# Altium project phoenix-c1.PrjPcb (part 1 of 3)
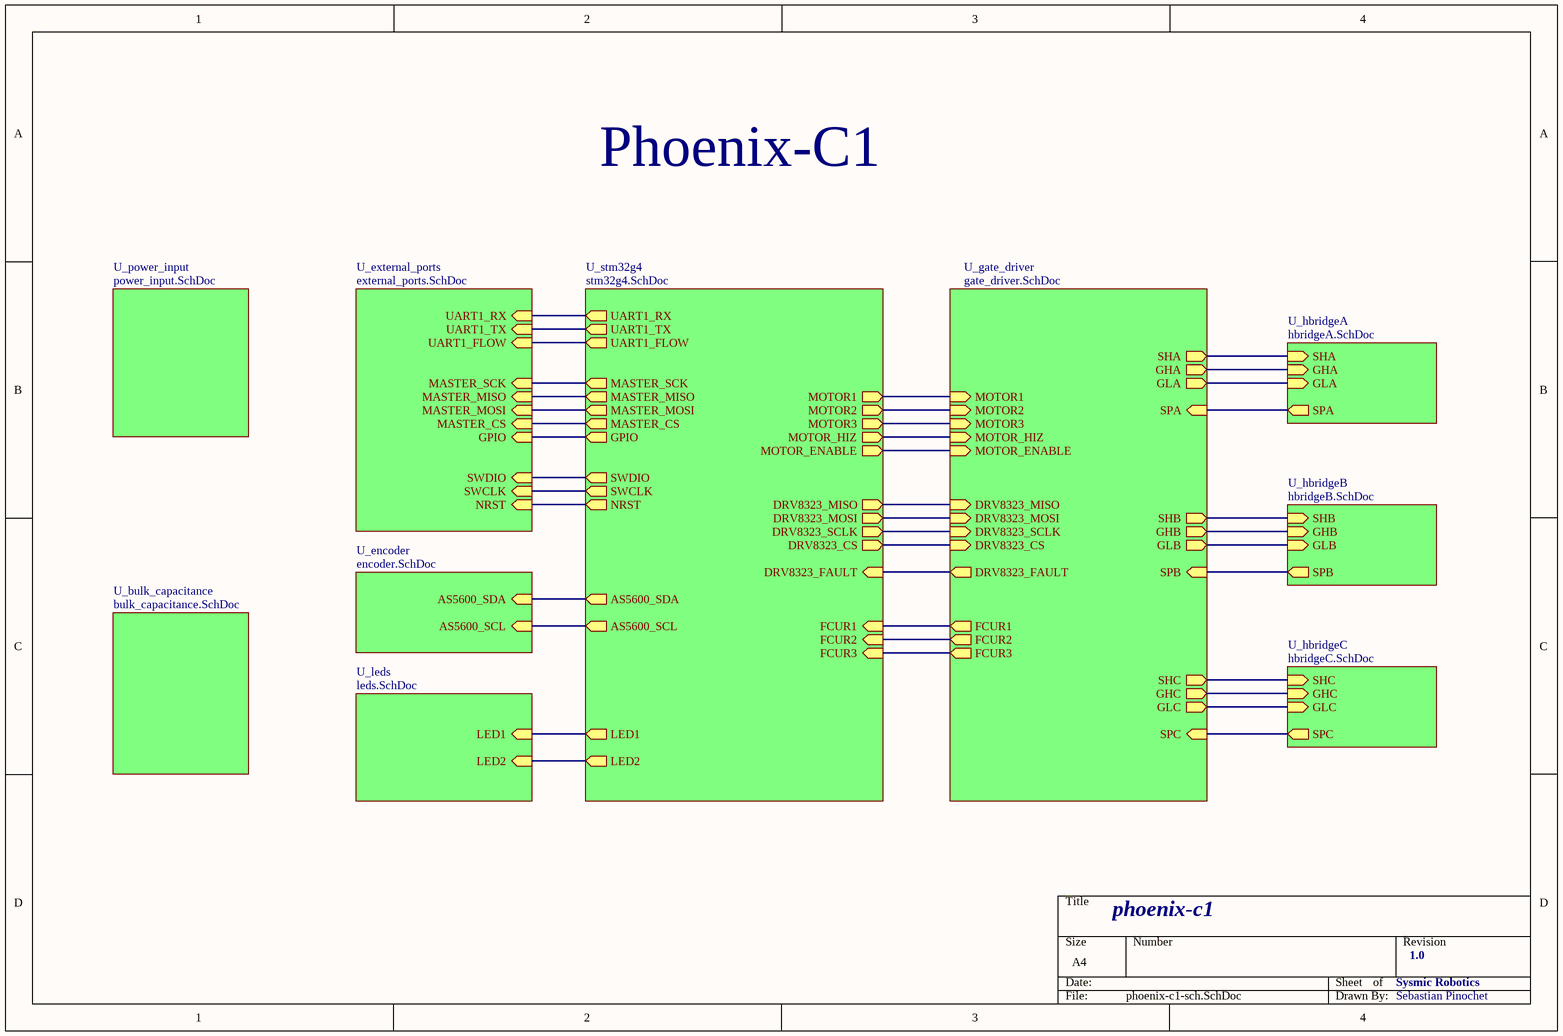
[diagram p0: phoenix-c1-sch.SchDoc]
11 sheets, 71 parts. Net scope: hierarchical (ports join the sheet entries above them; power ports are global).
Board file: phoenix-c1.PcbDoc
Sheets:
  phoenix-c1-sch.SchDoc
    U_bulk_capacitance = bulk_capacitance.SchDoc
    U_encoder = encoder.SchDoc
    U_hbridgeA = hbridgeA.SchDoc
    U_hbridgeB = hbridgeB.SchDoc
    U_hbridgeC = hbridgeC.SchDoc
    U_power_input = power_input.SchDoc
    U_stm32g4 = stm32g4.SchDoc
    U_external_ports = external_ports.SchDoc
    U_leds = leds.SchDoc
    U_gate_driver = gate_driver.SchDoc

## Sheet phoenix-c1-sch.SchDoc
size A4; SheetNumber: 1; SheetTotal: 11

### Sub-sheets
U_bulk_capacitance = bulk_capacitance.SchDoc: no entries
U_encoder = encoder.SchDoc: AS5600_SCL (in), AS5600_SDA (in)
U_external_ports = external_ports.SchDoc: SWCLK (in), NRST (in), SWDIO (in), GPIO (in), MASTER_CS (in), MASTER_MOSI (in), MASTER_MISO (in), MASTER_SCK (in), UART1_RX (in), UART1_TX (in), UART1_FLOW (in)
U_gate_driver = gate_driver.SchDoc: MOTOR2 (in), MOTOR1 (in), MOTOR3 (in), MOTOR_ENABLE (in), DRV8323_MISO (in), DRV8323_MOSI (in), DRV8323_SCLK (in), DRV8323_CS (in), MOTOR_HIZ (in), DRV8323_FAULT (out), GHA (out), SHA (out), GLA (out), SPA (in), GHB (out), SHB (out), GLB (out), SPB (in), GHC (out), SHC (out), GLC (out), SPC (in), FCUR1 (out), FCUR2 (out), FCUR3 (out)
U_hbridgeA = hbridgeA.SchDoc: SHA (in), GHA (in), SPA (out), GLA (in)
U_hbridgeB = hbridgeB.SchDoc: SHB (in), GHB (in), SPB (out), GLB (in)
U_hbridgeC = hbridgeC.SchDoc: SHC (in), GHC (in), SPC (out), GLC (in)
U_leds = leds.SchDoc: LED1 (in), LED2 (in)
U_power_input = power_input.SchDoc: no entries
U_stm32g4 = stm32g4.SchDoc: MOTOR1 (out), MOTOR2 (out), MOTOR3 (out), FCUR1 (in), FCUR2 (in), FCUR3 (in), AS5600_SCL (out), AS5600_SDA (out), DRV8323_SCLK (out), DRV8323_MISO (out), DRV8323_MOSI (out), DRV8323_CS (out), DRV8323_FAULT (in), MOTOR_HIZ (out), MOTOR_ENABLE (out), GPIO (out), MASTER_CS (out), MASTER_MOSI (out), MASTER_MISO (out), MASTER_SCK (out), UART1_RX (out), UART1_TX (out), UART1_FLOW (out), LED1 (out), LED2 (out), SWCLK (out), NRST (out), SWDIO (out)

### Nets
AS5600_SCL: sheet U_encoder/AS5600_SCL, sheet U_stm32g4/AS5600_SCL
AS5600_SDA: sheet U_encoder/AS5600_SDA, sheet U_stm32g4/AS5600_SDA
DRV8323_CS: sheet U_stm32g4/DRV8323_CS, sheet U_gate_driver/DRV8323_CS
DRV8323_FAULT: sheet U_stm32g4/DRV8323_FAULT, sheet U_gate_driver/DRV8323_FAULT
DRV8323_MISO: sheet U_stm32g4/DRV8323_MISO, sheet U_gate_driver/DRV8323_MISO
DRV8323_MOSI: sheet U_stm32g4/DRV8323_MOSI, sheet U_gate_driver/DRV8323_MOSI
DRV8323_SCLK: sheet U_stm32g4/DRV8323_SCLK, sheet U_gate_driver/DRV8323_SCLK
FCUR1: sheet U_stm32g4/FCUR1, sheet U_gate_driver/FCUR1
FCUR2: sheet U_stm32g4/FCUR2, sheet U_gate_driver/FCUR2
FCUR3: sheet U_stm32g4/FCUR3, sheet U_gate_driver/FCUR3
GHA: sheet U_hbridgeA/GHA, sheet U_gate_driver/GHA
GHB: sheet U_hbridgeB/GHB, sheet U_gate_driver/GHB
GHC: sheet U_hbridgeC/GHC, sheet U_gate_driver/GHC
GLA: sheet U_hbridgeA/GLA, sheet U_gate_driver/GLA
GLB: sheet U_hbridgeB/GLB, sheet U_gate_driver/GLB
GLC: sheet U_hbridgeC/GLC, sheet U_gate_driver/GLC
GPIO: sheet U_stm32g4/GPIO, sheet U_external_ports/GPIO
LED1: sheet U_stm32g4/LED1, sheet U_leds/LED1
LED2: sheet U_stm32g4/LED2, sheet U_leds/LED2
MASTER_CS: sheet U_stm32g4/MASTER_CS, sheet U_external_ports/MASTER_CS
MASTER_MISO: sheet U_stm32g4/MASTER_MISO, sheet U_external_ports/MASTER_MISO
MASTER_MOSI: sheet U_stm32g4/MASTER_MOSI, sheet U_external_ports/MASTER_MOSI
MASTER_SCK: sheet U_stm32g4/MASTER_SCK, sheet U_external_ports/MASTER_SCK
MOTOR1: sheet U_stm32g4/MOTOR1, sheet U_gate_driver/MOTOR1
MOTOR2: sheet U_stm32g4/MOTOR2, sheet U_gate_driver/MOTOR2
MOTOR3: sheet U_stm32g4/MOTOR3, sheet U_gate_driver/MOTOR3
MOTOR_ENABLE: sheet U_stm32g4/MOTOR_ENABLE, sheet U_gate_driver/MOTOR_ENABLE
MOTOR_HIZ: sheet U_stm32g4/MOTOR_HIZ, sheet U_gate_driver/MOTOR_HIZ
NRST: sheet U_stm32g4/NRST, sheet U_external_ports/NRST
SHA: sheet U_hbridgeA/SHA, sheet U_gate_driver/SHA
SHB: sheet U_hbridgeB/SHB, sheet U_gate_driver/SHB
SHC: sheet U_hbridgeC/SHC, sheet U_gate_driver/SHC
SPA: sheet U_hbridgeA/SPA, sheet U_gate_driver/SPA
SPB: sheet U_hbridgeB/SPB, sheet U_gate_driver/SPB
SPC: sheet U_hbridgeC/SPC, sheet U_gate_driver/SPC
SWCLK: sheet U_stm32g4/SWCLK, sheet U_external_ports/SWCLK
SWDIO: sheet U_stm32g4/SWDIO, sheet U_external_ports/SWDIO
UART1_FLOW: sheet U_stm32g4/UART1_FLOW, sheet U_external_ports/UART1_FLOW
UART1_RX: sheet U_stm32g4/UART1_RX, sheet U_external_ports/UART1_RX
UART1_TX: sheet U_stm32g4/UART1_TX, sheet U_external_ports/UART1_TX

### Notes on the sheet
- Phoenix-C1
- phoenix-c1
- Sysmic Robotics
- 1.0
- Sebastian Pinochet

## Sheet bulk_capacitance.SchDoc
size A4; SheetNumber: 4; SheetTotal: 11
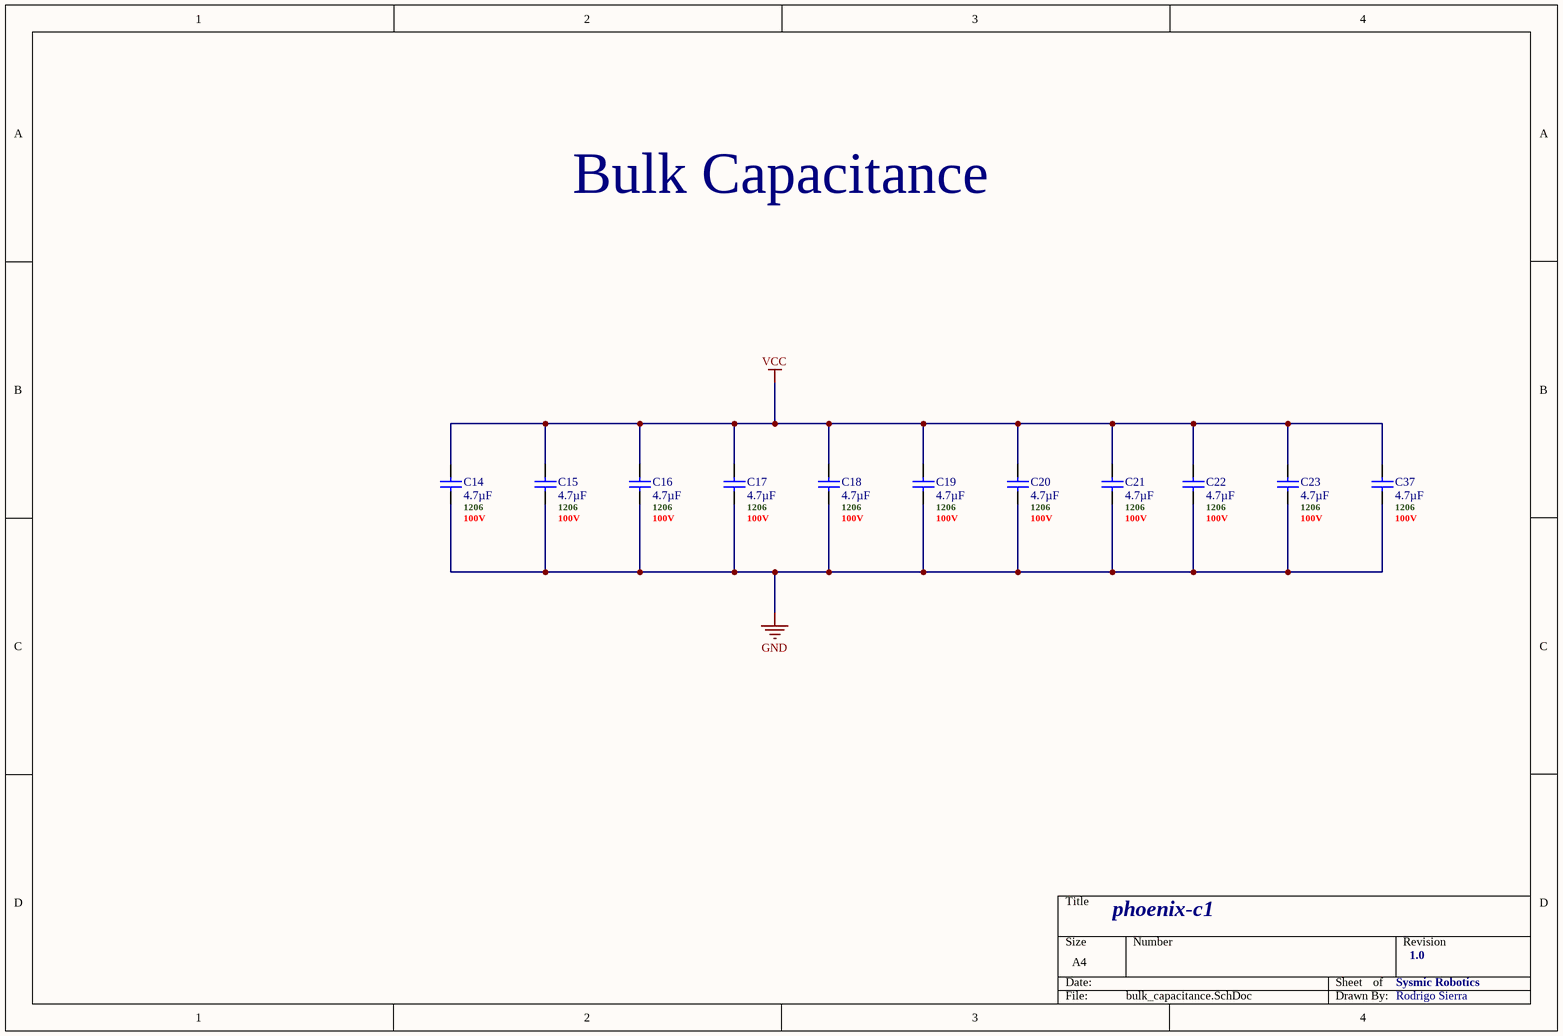
[diagram p1: bulk_capacitance.SchDoc]

### Parts
C14  4.7µF  .Case/Package: 1206  .Voltage Rating (DC): 100V  [C1206 - MURATA]
C15  4.7µF  .Case/Package: 1206  .Voltage Rating (DC): 100V  [C1206 - MURATA]
C16  4.7µF  .Case/Package: 1206  .Voltage Rating (DC): 100V  [C1206 - MURATA]
C17  4.7µF  .Case/Package: 1206  .Voltage Rating (DC): 100V  [C1206 - MURATA]
C18  4.7µF  .Case/Package: 1206  .Voltage Rating (DC): 100V  [C1206 - MURATA]
C19  4.7µF  .Case/Package: 1206  .Voltage Rating (DC): 100V  [C1206 - MURATA]
C20  4.7µF  .Case/Package: 1206  .Voltage Rating (DC): 100V  [C1206 - MURATA]
C21  4.7µF  .Case/Package: 1206  .Voltage Rating (DC): 100V  [C1206 - MURATA]
C22  4.7µF  .Case/Package: 1206  .Voltage Rating (DC): 100V  [C1206 - MURATA]
C23  4.7µF  .Case/Package: 1206  .Voltage Rating (DC): 100V  [C1206 - MURATA]
C37  4.7µF  .Case/Package: 1206  .Voltage Rating (DC): 100V  [C1206 - MURATA]

### Nets
GND: C14.2 C15.2 C16.2 C17.2 C18.2 C19.2 C20.2 C21.2 C22.2 C23.2 C37.2
VCC: C14.1 C15.1 C16.1 C17.1 C18.1 C19.1 C20.1 C21.1 C22.1 C23.1 C37.1

### Notes on the sheet
- Bulk Capacitance
- phoenix-c1
- Sysmic Robotics
- 1.0
- Rodrigo Sierra

### Library data of the parts
C14-C23 C37 = GRJ31CC72A475KE01K: Ceramic Capacitor, Multilayer, Ceramic, 100V, 10% +Tol, 10% -Tol, X7S, 22% TC, 4.7uF, Surface Mount, 1206; Manufacturer: Murata; Manufacturer Lifecycle Status: IN PRODUCTION; Supplier: Mouser; Supplier Part Number: 81-GRJ31CC72A475KE1K; Manufacturer Part Number: GRJ31CC72A475KE01K; RoHS: Compliant; Category: Ceramic Capacitors; Stock: 47114; Pricing: 1=0,8, 10=0,387, 50=0,387, 100=0,351, 1000=0,272, 10000=0,242 (USD); Value: 4.7µF; Case/Package: 1206; Dielectric: X7S; Dielectric Material: Ceramic; Height: 1.6mm; Length: 3.2mm; Lifecycle Status: Production; Max Operating Temperature: 125°C; Min Operating Temperature: -55°C; Mounting Technology: Surface Mount; Number of Terminals: 2; REACH SVHC: Yes; Thickness: 1.6mm; Voltage Rating (DC): 100V; Width: 1.6mm; ComponentLink1URL: https://datasheet.octopart.com:443/GRJ31CC72A475KE01K-Murata-datasheet-165579666.pdf?src-supplier=TME; ComponentLink1Description: https://datasheet.octopart.com:443/GRJ31CC72A475KE01K-Murata-datasheet-165579666.pdf?src-supplier=TME; ComponentLink2URL: https://datasheet.octopart.com/GRJ31CC72A475KE01K-Murata-datasheet-12515295.pdf; ComponentLink2Description: https://datasheet.octopart.com/GRJ31CC72A475KE01K-Murata-datasheet-12515295.pdf; ComponentLink3URL: https://datasheet.octopart.com/GRJ31CC72A475KE01K-Murata-datasheet-12510076.pdf; ComponentLink3Description: https://datasheet.octopart.com/GRJ31CC72A475KE01K-Murata-datasheet-12510076.pdf; ComponentLink4URL: https://datasheet.octopart.com/GRJ31CC72A475KE01K-Murata-datasheet-11978611.pdf; ComponentLink4Description: https://datasheet.octopart.com/GRJ31CC72A475KE01K-Murata-datasheet-11978611.pdf; ComponentLink5URL: https://datasheet.octopart.com/GRJ31CC72A475KE01K-Murata-datasheet-10025737.pdf; ComponentLink5Description: https://datasheet.octopart.com/GRJ31CC72A475KE01K-Murata-datasheet-10025737.pdf; ComponentLink6URL: https://datasheet.octopart.com/GRJ31CC72A475KE01K-Murata-datasheet-8819587.pdf; ComponentLink6Description: https://datasheet.octopart.com/GRJ31CC72A475KE01K-Murata-datasheet-8819587.pdf; ComponentLink7URL: http://sigma.octopart.com:80/reach_statement/Murata-company-16.pdf?src-supplier=Compliance+Statements; ComponentLink7Description: http://sigma.octopart.com:80/reach_statement/Murata-company-16.pdf?src-supplier=Compliance+Statements; Supplier 1: Mouser; Supplier Part Number 1: 81-GRJ31CC72A475KE1K

## Sheet encoder.SchDoc
size A4; SheetNumber: 9; SheetTotal: 11
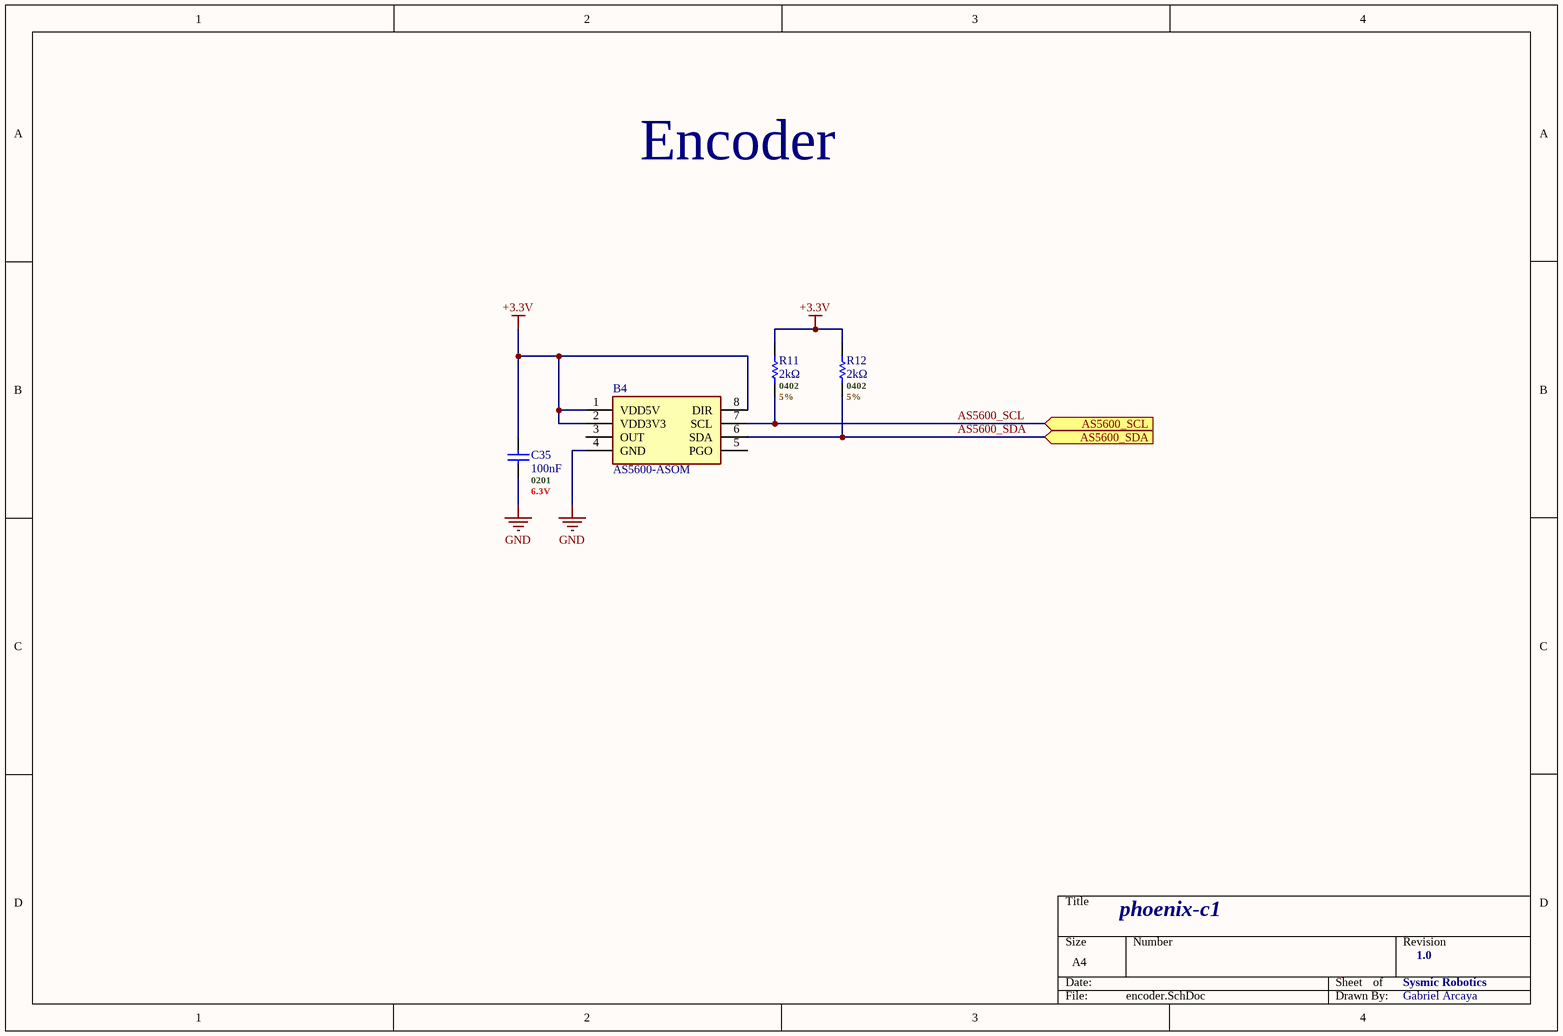
[diagram p2: encoder.SchDoc]

### Parts
B4  AS5600-ASOM  [SOIC-8 - OSRAM]
C35  100nF  .Case/Package: 0201  .Voltage Rating (DC): 6.3V  [C0201 - MURATA]
R11  2kΩ  .Case/Package: 0402  .Tolerance: 5%  [R0402 - YAGEO]
R12  2kΩ  .Case/Package: 0402  .Tolerance: 5%  [R0402 - YAGEO]

### Ports
AS5600_SCL (in, see phoenix-c1-sch[2C], stm32g4[3C]), AS5600_SDA (in, see phoenix-c1-sch[2C], stm32g4[3C])

### Nets
+3.3V: B4.1(VDD5V) B4.2(VDD3V3) B4.8(DIR) C35.2 R11.2 R12.2
GND: B4.4(GND) C35.1
AS5600_SCL: B4.7(SCL) R11.1 ; port AS5600_SCL
AS5600_SDA: B4.6(SDA) R12.1 ; port AS5600_SDA

Not connected (* = marked no-connect by the designer): B4 3(OUT) 5(PGO)

### Notes on the sheet
- Encoder
- phoenix-c1
- Sysmic Robotics
- 1.0
- Gabriel Arcaya

### Library data of the parts
B4 = AS5600-ASOM: IC SENSOR MAG ROTARY 12BIT 8SOIC; Manufacturer_Name: ams OSRAM; Geometry.Height: 1.75mm; Mouser Part Number: 985-AS5600-ASOM; Mouser Price/Stock: https://www.mouser.co.uk/ProductDetail/ams-OSRAM/AS5600-ASOM?qs=KTMMzrZdriG6aU1h9lJCUQ%3D%3D; Manufacturer_Part_Number: AS5600-ASOM; Datasheet Link: https://datasheet.datasheetarchive.com/originals/distributors/DKDS-11/214624.pdf; Supplier 1: Mouser; Supplier Part Number 1: 985-AS5600-ASOM
C35 = GRT033R60J104KE01J: Ceramic Capacitor, Multilayer, Ceramic, 6.3V, 10% +Tol, 10% -Tol, X5R, 15% TC, 0.1uF, Surface Mount, 0201; Manufacturer: Murata; Manufacturer Lifecycle Status: IN PRODUCTION; Supplier: Mouser; Supplier Part Number: 81-GRT033R60J104KE1J; Manufacturer Part Number: GRT033R60J104KE01J; RoHS: Compliant; Category: Ceramic Capacitors; Stock: 150000; Pricing: 1=0,1, 10=0,017, 50=0,017, 100=0,014, 1000=0,009, 10000=0,007 (USD); Value: 100nF; Case/Package: 0201; Dielectric Material: Ceramic; Height: 300µm; Length: 600µm; Lifecycle Status: Production; Material: Ceramic; Max Operating Temperature: 85°C; Min Operating Temperature: -55°C; Mounting Technology: Surface Mount; Number of Terminals: 2; REACH SVHC: Yes; Thickness: 300µm; Tolerance: 10%; Voltage Rating: 6.3V; Voltage Rating (DC): 6.3V; Width: 300µm; ComponentLink1URL: https://datasheet.octopart.com:443/GRT033R60J104KE01J-Murata-datasheet-141283033.pdf?src-supplier=Geoflip; ComponentLink1Description: https://datasheet.octopart.com:443/GRT033R60J104KE01J-Murata-datasheet-141283033.pdf?src-supplier=Geoflip; ComponentLink2URL: https://datasheet.octopart.com:443/GRT033R60J104KE01J-Murata-datasheet-140710645.pdf?src-supplier=Ciiva; ComponentLink2Description: https://datasheet.octopart.com:443/GRT033R60J104KE01J-Murata-datasheet-140710645.pdf?src-supplier=Ciiva; ComponentLink3URL: https://datasheet.octopart.com:443/GRT033R60J104KE01J-Murata-datasheet-138748272.pdf?src-supplier=Ciiva; ComponentLink3Description: https://datasheet.octopart.com:443/GRT033R60J104KE01J-Murata-datasheet-138748272.pdf?src-supplier=Ciiva; ComponentLink4URL: http://sigma.octopart.com:80/reach_statement/Murata-company-16.pdf?src-supplier=Compliance+Statements; ComponentLink4Description: http://sigma.octopart.com:80/reach_statement/Murata-company-16.pdf?src-supplier=Compliance+Statements; Supplier 1: Mouser; Supplier Part Number 1: 81-GRT033R60J104KE1J
R11 R12 = AF0402JR-072KL: Anti-Sulfurated Chip Resistor Thick Film 0402 2kOhm 5% Paper T/R; Manufacturer: Yageo Group; Max Power Dissipation: 63mW; Power Dissipation: 62.5mW; Temperature Coefficient: 100ppm/°C; Voltage Rating: 50V; Supplier: Mouser; Supplier Part Number: 603-AF0402JR-072KL; Manufacturer Part Number: AF0402JR-072KL; RoHS: Compliant; Category: Chip SMD Resistors; Stock: 66785; Pricing: 1=0,1, 10=0,007, 50=0,007, 100=0,006, 1000=0,005, 10000=0,005 (USD); Case/Package: 0402; China RoHS: Non-Compliant; Composition: Thick Film; Features: Anti-Sulfur, Moisture Resistant; Height: 350µm; Length: 990.6µm; Lifecycle Status: Production; Max Operating Temperature: 155°C; Min Operating Temperature: -55°C; Mounting Technology: Surface Mount; Number of Terminals: 2; Number of Terminations: 2; Packaging: Tape & Reel; Power Rating: 62.5mW; REACH SVHC: Yes; Value: 2kΩ; Tolerance: 5%; Width: 500µm; Working Voltage: 50V; ComponentLink1URL: https://datasheet.octopart.com:443/AF0402JR-072KL-Yageo-datasheet-182189395.pdf?src-supplier=IHS; ComponentLink1Description: https://datasheet.octopart.com:443/AF0402JR-072KL-Yageo-datasheet-182189395.pdf?src-supplier=IHS; ComponentLink2URL: https://datasheet.octopart.com:443/AF0402JR-072KL-Yageo-datasheet-153645569.pdf?src-supplier=Upverter; ComponentLink2Description: https://datasheet.octopart.com:443/AF0402JR-072KL-Yageo-datasheet-153645569.pdf?src-supplier=Upverter; ComponentLink3URL: https://sigma.octopart.com:443/138820526/technical_drawing/Yageo-AF0402JR-072KL.pdf?src-supplier=Upverter; ComponentLink3Description: https://sigma.octopart.com:443/138820526/technical_drawing/Yageo-AF0402JR-072KL.pdf?src-supplier=Upverter; ComponentLink4URL: https://datasheet.octopart.com/AF0402JR-072KL-Yageo-datasheet-68296209.pdf; ComponentLink4Description: https://datasheet.octopart.com/AF0402JR-072KL-Yageo-datasheet-68296209.pdf; ComponentLink5URL: https://datasheet.octopart.com:443/AF0402JR-072KL-Yageo-datasheet-164730775.pdf?src-supplier=Future+Electronics; ComponentLink5Description: https://datasheet.octopart.com:443/AF0402JR-072KL-Yageo-datasheet-164730775.pdf?src-supplier=Future+Electronics; ComponentLink6URL: https://datasheet.octopart.com:443/AF0402JR-072KL-Yageo-datasheet-137481464.pdf?src-supplier=Future+Electronics; ComponentLink6Description: https://datasheet.octopart.com:443/AF0402JR-072KL-Yageo-datasheet-137481464.pdf?src-supplier=Future+Electronics; ComponentLink7URL: https://datasheet.octopart.com:443/AF0402JR-072KL-Yageo-datasheet-27714391.pdf?src-supplier=Future+Electronics; ComponentLink7Description: https://datasheet.octopart.com:443/AF0402JR-072KL-Yageo-datasheet-27714391.pdf?src-supplier=Future+Electronics; ComponentLink8URL: http://sigma.octopart.com:80/rohs_statement/Yageo-company-2.pdf?src-supplier=Compliance+Statements; ComponentLink8Description: http://sigma.octopart.com:80/rohs_statement/Yageo-company-2.pdf?src-supplier=Compliance+Statements; ComponentLink9URL: http://sigma.octopart.com:80/conflict_mineral_statement/Yageo-company-3.pdf?src-supplier=Compliance+Statements; ComponentLink9Description: http://sigma.octopart.com:80/conflict_mineral_statement/Yageo-company-3.pdf?src-supplier=Compliance+Statements; Supplier 1: Mouser; Supplier Part Number 1: 603-AF0402JR-072KL

## Sheet hbridgeA.SchDoc
size A4; SheetNumber: 5; SheetTotal: 11
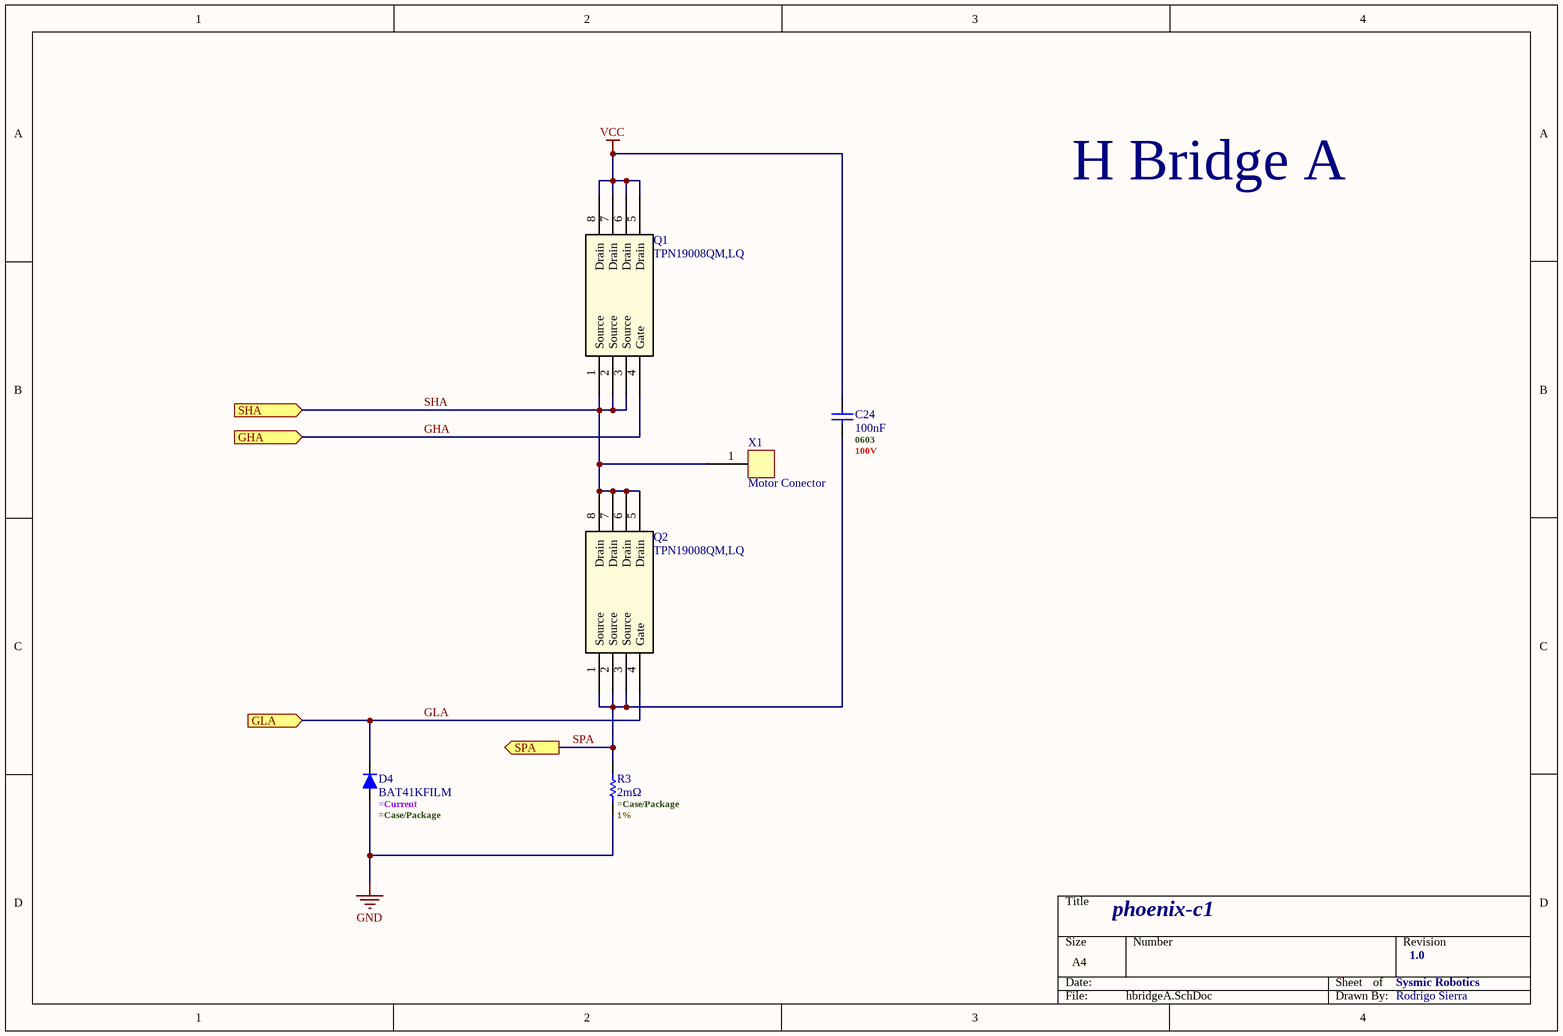
[diagram p3: hbridgeA.SchDoc]

### Parts
C24  100nF  .Case/Package: 0603  .Voltage Rating (DC): 100V  [C0603 - MURATA]
D4  BAT41KFILM  [DSOD-523 - STMicroelectronics]
Q1  TPN19008QM,LQ  [8-TSON - TOSHIBA]
Q2  TPN19008QM,LQ  [8-TSON - TOSHIBA]
R3  2mΩ  .Tolerance: 1%  [R0805 - SEI]
X1  Motor Conector  [CONN_PHASE01x01]

### Ports
GHA (in, see phoenix-c1-sch[4B], gate_driver[3B]), GLA (in, see phoenix-c1-sch[4B], gate_driver[3B]), SHA (in, see phoenix-c1-sch[4B], gate_driver[3B]), SPA (out, see phoenix-c1-sch[4B], gate_driver[3B])

### Nets
GND: D4.2 R3.1
VCC: C24.2 Q1.5(Drain) Q1.6(Drain) Q1.7(Drain) Q1.8(Drain)
GHA: Q1.4(Gate) ; port GHA
GLA: D4.1 Q2.4(Gate) ; port GLA
SHA: Q1.1(Source) Q1.2(Source) Q1.3(Source) Q2.5(Drain) Q2.6(Drain) Q2.7(Drain) Q2.8(Drain) X1.1(Conn) ; port SHA
SPA: C24.1 Q2.1(Source) Q2.2(Source) Q2.3(Source) R3.2 ; port SPA

### Notes on the sheet
- H Bridge A
- phoenix-c1
- Sysmic Robotics
- 1.0
- Rodrigo Sierra

### Library data of the parts
C24 = GCJ188R72A104KA01D: Cap Ceramic 0.1uF 100V X7R 10% Pad SMD 0603 Soft Termination 125C Automotive T/R; Manufacturer: Murata; Manufacturer Lifecycle Status: IN PRODUCTION; Supplier: Avnet; Supplier Part Number: GCJ188R72A104KA01D; Manufacturer Part Number: GCJ188R72A104KA01D; RoHS: Compliant; Category: Ceramic Capacitors; Stock: 848000; Pricing: 4000=0,02065 (USD); Value: 100nF; Case/Package: 0603; Case Code (Imperial): 0603; Case Code (Metric): 1608; Dielectric Material: Ceramic; Features: Soft Termination; Height: 800µm; Lead Free: Lead Free; Length: 1.6mm; Lifecycle Status: Production; Material: Ceramic; Max Operating Temperature: 125°C; Min Operating Temperature: -55°C; Mounting Technology: Surface Mount; Number of Terminals: 2; Ratings: AEC-Q200; REACH SVHC: Yes; Schedule B: 8532240020, 8532240020|8532240020, 8532240020|8532240020|8532240020, 8532240020|8532240020|8532240020|8532240020; Tolerance: 10%; Voltage Rating: 100V; Voltage Rating (DC): 100V; Width: 800µm; ComponentLink1URL: https://datasheet.octopart.com:443/GCJ188R72A104KA01D-Murata-datasheet-141264712.pdf?src-supplier=Geoflip; ComponentLink1Description: https://datasheet.octopart.com:443/GCJ188R72A104KA01D-Murata-datasheet-141264712.pdf?src-supplier=Geoflip; ComponentLink2URL: https://datasheet.octopart.com:443/GCJ188R72A104KA01D-Murata-datasheet-140654819.pdf?src-supplier=Ciiva; ComponentLink2Description: https://datasheet.octopart.com:443/GCJ188R72A104KA01D-Murata-datasheet-140654819.pdf?src-supplier=Ciiva; ComponentLink3URL: https://datasheet.octopart.com:443/GCJ188R72A104KA01D-Murata-datasheet-138714490.pdf?src-supplier=Ciiva; ComponentLink3Description: https://datasheet.octopart.com:443/GCJ188R72A104KA01D-Murata-datasheet-138714490.pdf?src-supplier=Ciiva; ComponentLink4URL: https://datasheet.octopart.com:443/GCJ188R72A104KA01D-Murata-datasheet-165611796.pdf?src-supplier=TME; ComponentLink4Description: https://datasheet.octopart.com:443/GCJ188R72A104KA01D-Murata-datasheet-165611796.pdf?src-supplier=TME; ComponentLink5URL: https://datasheet.octopart.com:443/GCJ188R72A104KA01D-Murata-datasheet-128592638.pdf?src-supplier=X-ON; ComponentLink5Description: https://datasheet.octopart.com:443/GCJ188R72A104KA01D-Murata-datasheet-128592638.pdf?src-supplier=X-ON; ComponentLink6URL: https://datasheet.octopart.com:443/GCJ188R72A104KA01D-Murata-datasheet-78375067.pdf?src-supplier=Future+Electronics; ComponentLink6Description: https://datasheet.octopart.com:443/GCJ188R72A104KA01D-Murata-datasheet-78375067.pdf?src-supplier=Future+Electronics; ComponentLink7URL: https://datasheet.octopart.com:443/GCJ188R72A104KA01D-Murata-datasheet-12532847.pdf?src-supplier=Future+Electronics; ComponentLink7Description: https://datasheet.octopart.com:443/GCJ188R72A104KA01D-Murata-datasheet-12532847.pdf?src-supplier=Future+Electronics; ComponentLink8URL: http://sigma.octopart.com:80/reach_statement/Murata-company-16.pdf?src-supplier=Compliance+Statements; ComponentLink8Description: http://sigma.octopart.com:80/reach_statement/Murata-company-16.pdf?src-supplier=Compliance+Statements; Supplier 1: Mouser; Supplier Part Number 1: 81-GCJ188R72A104KA1D
D4 = BAT41KFILM: Low Capacitance Small Signal 200 mA 1 V Schottky Diode Surface Mount - SOD-523; Manufacturer: STMicroelectronics; Average Rectified Current: 200mA; Value: 3pF; Element Configuration: Single; Forward Voltage: 450mV; Max Forward Surge Current (Ifsm): 1A; Max Junction Temperature (Tj): 150°C; Max Repetitive Reverse Voltage (Vrrm): 100V; Max Reverse Leakage Current: 100nA; Number of Elements: 1; Polarity: Standard; Supplier: Mouser; Supplier Part Number: 511-BAT41KFILM; Manufacturer Part Number: BAT41KFILM; RoHS: Compliant; Category: Schottky Diodes; Stock: 54328; Pricing: 1=0,34, 10=0,206, 50=0,206, 100=0,129, 1000=0,085, 10000=0,054 (USD); China RoHS: Compliant; Contact Plating: Tin; Current Rating: 200mA; Forward Current: 200mA; Height: 700µm; Lead Free: Lead Free; Length: 1.3mm; Lifecycle Status: Production; Max Operating Temperature: 150°C; Max Output current: 200mA; Max Reverse Voltage (DC): 100V; Max Surge Current: 1A; Min Operating Temperature: -65°C; Mounting Technology: Surface Mount; Pins: 2; Number of Terminals: 2; Output Current: 200mA; Packaging: Tape and Reel; Peak Non-Repetitive Surge Current: 1A; Peak Reverse Current: 100nA; Radiation Hardening: No; REACH SVHC: Yes; Reverse Standoff Voltage: 100V; Schedule B: 8541100070, 8541100070|8541100070|8541100070|8541100070|8541100070; Voltage Rating (DC): 100V; Width: 900µm; ComponentLink1URL: https://datasheet.octopart.com:443/BAT41KFILM-STMicroelectronics-datasheet-12514395.pdf?src-supplier=Upverter; ComponentLink1Description: https://datasheet.octopart.com:443/BAT41KFILM-STMicroelectronics-datasheet-12514395.pdf?src-supplier=Upverter; ComponentLink2URL: https://datasheet.octopart.com:443/BAT41KFILM-STMicroelectronics-datasheet-8379388.pdf?src-supplier=element14+APAC; ComponentLink2Description: https://datasheet.octopart.com:443/BAT41KFILM-STMicroelectronics-datasheet-8379388.pdf?src-supplier=element14+APAC; ComponentLink3URL: https://datasheet.octopart.com:443/BAT41KFILM-STMicroelectronics-datasheet-165583346.pdf?src-supplier=Newark; ComponentLink3Description: https://datasheet.octopart.com:443/BAT41KFILM-STMicroelectronics-datasheet-165583346.pdf?src-supplier=Newark; ComponentLink4URL: https://datasheet.octopart.com:443/BAT41KFILM-STMicroelectronics-datasheet-109502.pdf?src-supplier=Nu+Horizons; ComponentLink4Description: https://datasheet.octopart.com:443/BAT41KFILM-STMicroelectronics-datasheet-109502.pdf?src-supplier=Nu+Horizons; Supplier 1: Mouser; Supplier Part Number 1: 511-BAT41KFILM; .Current: =Current; .Case/Package: =Case/Package
Q1 Q2 = TPN19008QM,LQ: Power MOSFET, N Channel, 80 V, 38 A, 0.0147 ohm, TSON, Surface Mount; Manufacturer_Name: Toshiba Electronic Devices & Storage Corp.; Copyright: Copyright (C) 2025 Ultra Librarian. All rights reserved.; Manufacturer_Part_Number: TPN19008QM,LQ; RefDes: RefDes; Type: Type; Supplier 1: Mouser; Supplier Part Number 1: 757-TPN19008QM,LQ
R3 = CSSH0805FT2L00: Res Metal Alloy 0805 0.002 Ohm 1% 1W ±75ppm/C Pad SMD T/R Automotive AEC-Q200; Manufacturer: Stackpole Electronics; Temperature Coefficient: 75ppm/°C; Working Voltage: 44.7mV; Supplier: Mouser; Supplier Part Number: 708-CSSH0805FT2L00; Manufacturer Part Number: CSSH0805FT2L00; RoHS: Compliant; Category: Chip SMD Resistors; Stock: 6684; Pricing: 1=0,6, 10=0,385, 50=0,29, 100=0,261, 1000=0,188, 10000=0,144 (USD); Height: 350µm; Lifecycle Status: Production; Max Operating Temperature: 170°C; Min Operating Temperature: -55°C; Mounting Technology: Surface Mount; Number of Terminals: 2; Power Dissipation: 1W; REACH SVHC: Yes; Value: 2mΩ; Schedule B: 8533210045, 8533210045|8533210045|8533210045|8533210045|8533210045; Tolerance: 1%; Width: 1.3mm; ComponentLink1URL: https://datasheet.octopart.com:443/CSSH0805FT2L00-Stackpole-Electronics-datasheet-182147922.pdf?src-supplier=IHS; ComponentLink1Description: https://datasheet.octopart.com:443/CSSH0805FT2L00-Stackpole-Electronics-datasheet-182147922.pdf?src-supplier=IHS; ComponentLink2URL: https://datasheet.octopart.com:443/CSSH0805FT2L00-Stackpole-Electronics-datasheet-141193806.pdf?src-supplier=Stackpole+Electronics; ComponentLink2Description: https://datasheet.octopart.com:443/CSSH0805FT2L00-Stackpole-Electronics-datasheet-141193806.pdf?src-supplier=Stackpole+Electronics; ComponentLink3URL: https://datasheet.octopart.com:443/CSSH0805FT2L00-Stackpole-Electronics-datasheet-141158304.pdf?src-supplier=Stackpole+Electronics; ComponentLink3Description: https://datasheet.octopart.com:443/CSSH0805FT2L00-Stackpole-Electronics-datasheet-141158304.pdf?src-supplier=Stackpole+Electronics; ComponentLink4URL: https://datasheet.octopart.com:443/CSSH0805FT2L00-Stackpole-Electronics-datasheet-101746695.pdf?src-supplier=Future+Electronics; ComponentLink4Description: https://datasheet.octopart.com:443/CSSH0805FT2L00-Stackpole-Electronics-datasheet-101746695.pdf?src-supplier=Future+Electronics; ComponentLink5URL: http://sigma.octopart.com:80/141158211/reach_statement/Stackpole-Electronics-CSSH0805FT2L00.pdf?src-supplier=Compliance+Statements; ComponentLink5Description: http://sigma.octopart.com:80/141158211/reach_statement/Stackpole-Electronics-CSSH0805FT2L00.pdf?src-supplier=Compliance+Statements; ComponentLink6URL: http://sigma.octopart.com:80/141158212/rohs_statement/Stackpole-Electronics-CSSH0805FT2L00.pdf?src-supplier=Compliance+Statements; ComponentLink6Description: http://sigma.octopart.com:80/141158212/rohs_statement/Stackpole-Electronics-CSSH0805FT2L00.pdf?src-supplier=Compliance+Statements; Supplier 1: Mouser; Supplier Part Number 1: 708-CSSH0805FT2L00; .Case/Package: =Case/Package
X1 = Conn_01x01: Generic connector, single row

## Sheet hbridgeB.SchDoc
size A4; SheetNumber: 6; SheetTotal: 11
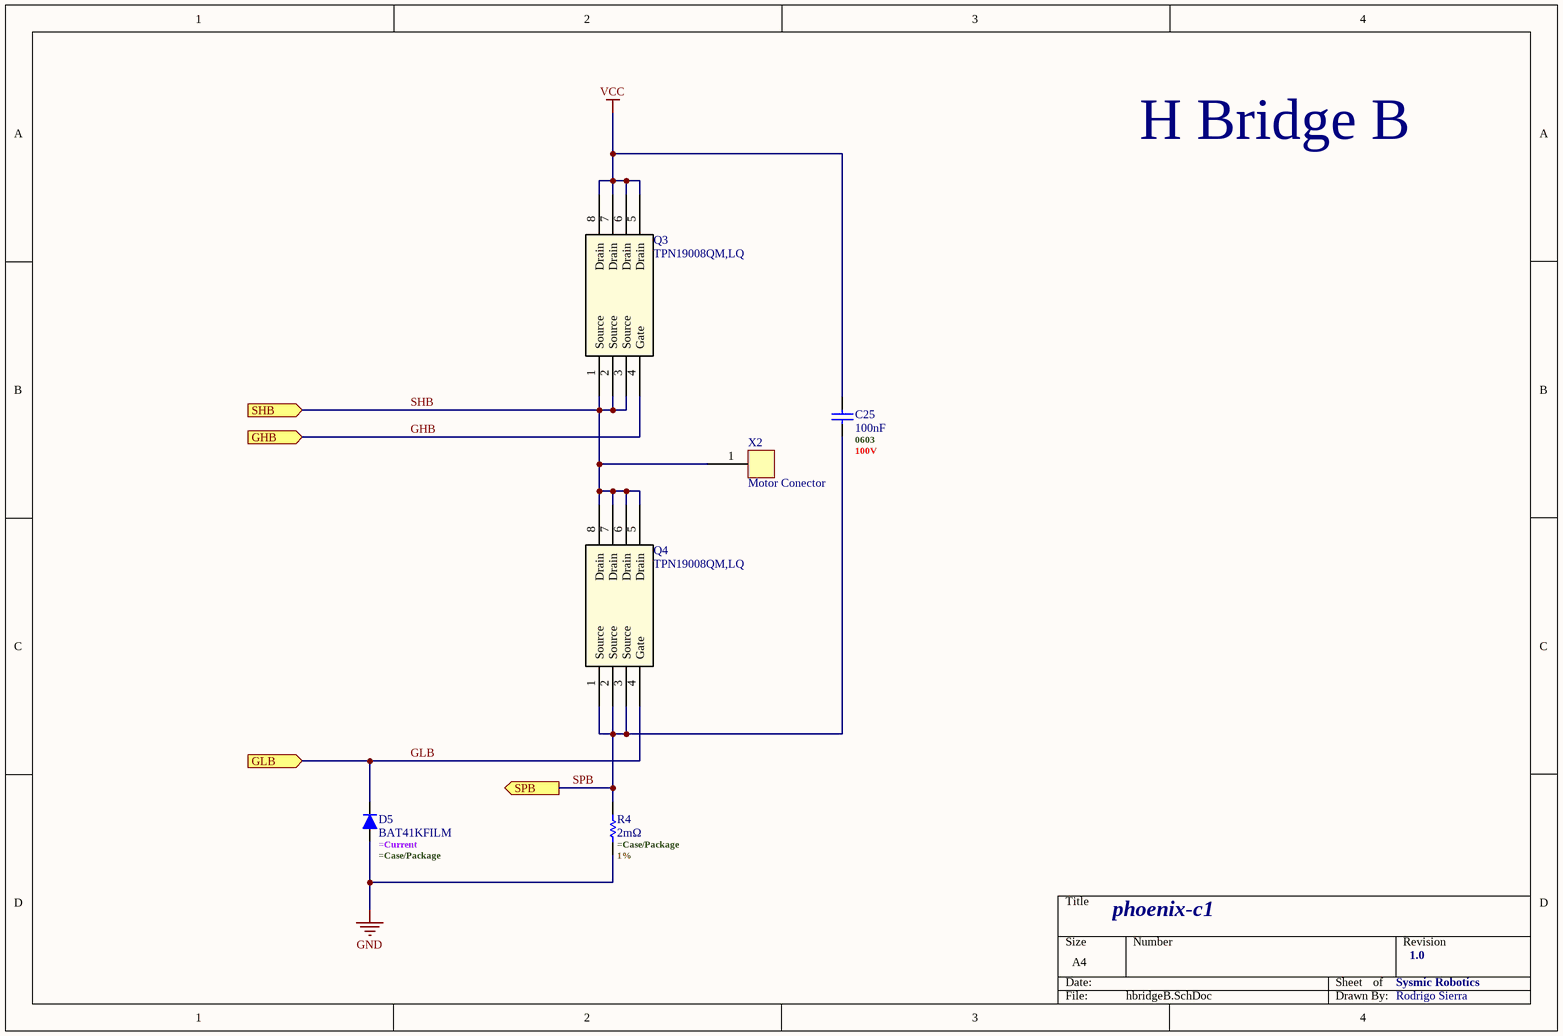
[diagram p4: hbridgeB.SchDoc]

### Parts
C25  100nF  .Case/Package: 0603  .Voltage Rating (DC): 100V  [C0603 - MURATA]
D5  BAT41KFILM  [DSOD-523 - STMicroelectronics]
Q3  TPN19008QM,LQ  [8-TSON - TOSHIBA]
Q4  TPN19008QM,LQ  [8-TSON - TOSHIBA]
R4  2mΩ  .Tolerance: 1%  [R0805 - SEI]
X2  Motor Conector  [CONN_PHASE01x01]

### Ports
GHB (in, see phoenix-c1-sch[4C], gate_driver[3B]), GLB (in, see phoenix-c1-sch[4C], gate_driver[3B]), SHB (in, see phoenix-c1-sch[4C], gate_driver[3B]), SPB (out, see phoenix-c1-sch[4C], gate_driver[3B])

### Nets
GND: D5.2 R4.1
VCC: C25.2 Q3.5(Drain) Q3.6(Drain) Q3.7(Drain) Q3.8(Drain)
GHB: Q3.4(Gate) ; port GHB
GLB: D5.1 Q4.4(Gate) ; port GLB
SHB: Q3.1(Source) Q3.2(Source) Q3.3(Source) Q4.5(Drain) Q4.6(Drain) Q4.7(Drain) Q4.8(Drain) X2.1(Conn) ; port SHB
SPB: C25.1 Q4.1(Source) Q4.2(Source) Q4.3(Source) R4.2 ; port SPB

### Notes on the sheet
- H Bridge B
- phoenix-c1
- Sysmic Robotics
- 1.0
- Rodrigo Sierra

### Library data of the parts
C25 = GCJ188R72A104KA01D: as C24 on sheet hbridgeA; Supplier: Avnet; Supplier Part Number: GCJ188R72A104KA01D; Manufacturer Part Number: GCJ188R72A104KA01D; RoHS: Compliant; Category: Ceramic Capacitors; Stock: 848000; Pricing: 4000=0,02065 (USD); Value: 100nF; Case/Package: 0603; Case Code (Imperial): 0603; Case Code (Metric): 1608; Dielectric Material: Ceramic; Features: Soft Termination; Height: 800µm; Lead Free: Lead Free; Length: 1.6mm; Lifecycle Status: Production; Material: Ceramic; Max Operating Temperature: 125°C; Min Operating Temperature: -55°C; Mounting Technology: Surface Mount; Number of Terminals: 2; Ratings: AEC-Q200; REACH SVHC: Yes; Schedule B: 8532240020, 8532240020|8532240020, 8532240020|8532240020|8532240020, 8532240020|8532240020|8532240020|8532240020; Tolerance: 10%; Voltage Rating: 100V; Voltage Rating (DC): 100V; Width: 800µm; ComponentLink1URL: https://datasheet.octopart.com:443/GCJ188R72A104KA01D-Murata-datasheet-141264712.pdf?src-supplier=Geoflip; ComponentLink1Description: https://datasheet.octopart.com:443/GCJ188R72A104KA01D-Murata-datasheet-141264712.pdf?src-supplier=Geoflip; ComponentLink2URL: https://datasheet.octopart.com:443/GCJ188R72A104KA01D-Murata-datasheet-140654819.pdf?src-supplier=Ciiva; ComponentLink2Description: https://datasheet.octopart.com:443/GCJ188R72A104KA01D-Murata-datasheet-140654819.pdf?src-supplier=Ciiva; ComponentLink3URL: https://datasheet.octopart.com:443/GCJ188R72A104KA01D-Murata-datasheet-138714490.pdf?src-supplier=Ciiva; ComponentLink3Description: https://datasheet.octopart.com:443/GCJ188R72A104KA01D-Murata-datasheet-138714490.pdf?src-supplier=Ciiva; ComponentLink4URL: https://datasheet.octopart.com:443/GCJ188R72A104KA01D-Murata-datasheet-165611796.pdf?src-supplier=TME; ComponentLink4Description: https://datasheet.octopart.com:443/GCJ188R72A104KA01D-Murata-datasheet-165611796.pdf?src-supplier=TME; ComponentLink5URL: https://datasheet.octopart.com:443/GCJ188R72A104KA01D-Murata-datasheet-128592638.pdf?src-supplier=X-ON; ComponentLink5Description: https://datasheet.octopart.com:443/GCJ188R72A104KA01D-Murata-datasheet-128592638.pdf?src-supplier=X-ON; ComponentLink6URL: https://datasheet.octopart.com:443/GCJ188R72A104KA01D-Murata-datasheet-78375067.pdf?src-supplier=Future+Electronics; ComponentLink6Description: https://datasheet.octopart.com:443/GCJ188R72A104KA01D-Murata-datasheet-78375067.pdf?src-supplier=Future+Electronics; ComponentLink7URL: https://datasheet.octopart.com:443/GCJ188R72A104KA01D-Murata-datasheet-12532847.pdf?src-supplier=Future+Electronics; ComponentLink7Description: https://datasheet.octopart.com:443/GCJ188R72A104KA01D-Murata-datasheet-12532847.pdf?src-supplier=Future+Electronics; ComponentLink8URL: http://sigma.octopart.com:80/reach_statement/Murata-company-16.pdf?src-supplier=Compliance+Statements; ComponentLink8Description: http://sigma.octopart.com:80/reach_statement/Murata-company-16.pdf?src-supplier=Compliance+Statements; Supplier 1: Mouser; Supplier Part Number 1: 81-GCJ188R72A104KA1D
D5 = BAT41KFILM: as D4 on sheet hbridgeA; Supplier: Mouser; Supplier Part Number: 511-BAT41KFILM; Manufacturer Part Number: BAT41KFILM; RoHS: Compliant; Category: Schottky Diodes; Stock: 54328; Pricing: 1=0,34, 10=0,206, 50=0,206, 100=0,129, 1000=0,085, 10000=0,054 (USD); China RoHS: Compliant; Contact Plating: Tin; Current Rating: 200mA; Forward Current: 200mA; Height: 700µm; Lead Free: Lead Free; Length: 1.3mm; Lifecycle Status: Production; Max Operating Temperature: 150°C; Max Output current: 200mA; Max Reverse Voltage (DC): 100V; Max Surge Current: 1A; Min Operating Temperature: -65°C; Mounting Technology: Surface Mount; Pins: 2; Number of Terminals: 2; Output Current: 200mA; Packaging: Tape and Reel; Peak Non-Repetitive Surge Current: 1A; Peak Reverse Current: 100nA; Radiation Hardening: No; REACH SVHC: Yes; Reverse Standoff Voltage: 100V; Schedule B: 8541100070, 8541100070|8541100070|8541100070|8541100070|8541100070; Voltage Rating (DC): 100V; Width: 900µm; ComponentLink1URL: https://datasheet.octopart.com:443/BAT41KFILM-STMicroelectronics-datasheet-12514395.pdf?src-supplier=Upverter; ComponentLink1Description: https://datasheet.octopart.com:443/BAT41KFILM-STMicroelectronics-datasheet-12514395.pdf?src-supplier=Upverter; ComponentLink2URL: https://datasheet.octopart.com:443/BAT41KFILM-STMicroelectronics-datasheet-8379388.pdf?src-supplier=element14+APAC; ComponentLink2Description: https://datasheet.octopart.com:443/BAT41KFILM-STMicroelectronics-datasheet-8379388.pdf?src-supplier=element14+APAC; ComponentLink3URL: https://datasheet.octopart.com:443/BAT41KFILM-STMicroelectronics-datasheet-165583346.pdf?src-supplier=Newark; ComponentLink3Description: https://datasheet.octopart.com:443/BAT41KFILM-STMicroelectronics-datasheet-165583346.pdf?src-supplier=Newark; ComponentLink4URL: https://datasheet.octopart.com:443/BAT41KFILM-STMicroelectronics-datasheet-109502.pdf?src-supplier=Nu+Horizons; ComponentLink4Description: https://datasheet.octopart.com:443/BAT41KFILM-STMicroelectronics-datasheet-109502.pdf?src-supplier=Nu+Horizons; Supplier 1: Mouser; Supplier Part Number 1: 511-BAT41KFILM; .Current: =Current; .Case/Package: =Case/Package
Q3 Q4 = TPN19008QM,LQ: as Q1 on sheet hbridgeA; Copyright: Copyright (C) 2025 Ultra Librarian. All rights reserved.; Manufacturer_Part_Number: TPN19008QM,LQ; RefDes: RefDes; Type: Type; Supplier 1: Mouser; Supplier Part Number 1: 757-TPN19008QM,LQ
R4 = CSSH0805FT2L00: as R3 on sheet hbridgeA; Supplier: Mouser; Supplier Part Number: 708-CSSH0805FT2L00; Manufacturer Part Number: CSSH0805FT2L00; RoHS: Compliant; Category: Chip SMD Resistors; Stock: 6684; Pricing: 1=0,6, 10=0,385, 50=0,29, 100=0,261, 1000=0,188, 10000=0,144 (USD); Height: 350µm; Lifecycle Status: Production; Max Operating Temperature: 170°C; Min Operating Temperature: -55°C; Mounting Technology: Surface Mount; Number of Terminals: 2; Power Dissipation: 1W; REACH SVHC: Yes; Value: 2mΩ; Schedule B: 8533210045, 8533210045|8533210045|8533210045|8533210045|8533210045; Tolerance: 1%; Width: 1.3mm; ComponentLink1URL: https://datasheet.octopart.com:443/CSSH0805FT2L00-Stackpole-Electronics-datasheet-182147922.pdf?src-supplier=IHS; ComponentLink1Description: https://datasheet.octopart.com:443/CSSH0805FT2L00-Stackpole-Electronics-datasheet-182147922.pdf?src-supplier=IHS; ComponentLink2URL: https://datasheet.octopart.com:443/CSSH0805FT2L00-Stackpole-Electronics-datasheet-141193806.pdf?src-supplier=Stackpole+Electronics; ComponentLink2Description: https://datasheet.octopart.com:443/CSSH0805FT2L00-Stackpole-Electronics-datasheet-141193806.pdf?src-supplier=Stackpole+Electronics; ComponentLink3URL: https://datasheet.octopart.com:443/CSSH0805FT2L00-Stackpole-Electronics-datasheet-141158304.pdf?src-supplier=Stackpole+Electronics; ComponentLink3Description: https://datasheet.octopart.com:443/CSSH0805FT2L00-Stackpole-Electronics-datasheet-141158304.pdf?src-supplier=Stackpole+Electronics; ComponentLink4URL: https://datasheet.octopart.com:443/CSSH0805FT2L00-Stackpole-Electronics-datasheet-101746695.pdf?src-supplier=Future+Electronics; ComponentLink4Description: https://datasheet.octopart.com:443/CSSH0805FT2L00-Stackpole-Electronics-datasheet-101746695.pdf?src-supplier=Future+Electronics; ComponentLink5URL: http://sigma.octopart.com:80/141158211/reach_statement/Stackpole-Electronics-CSSH0805FT2L00.pdf?src-supplier=Compliance+Statements; ComponentLink5Description: http://sigma.octopart.com:80/141158211/reach_statement/Stackpole-Electronics-CSSH0805FT2L00.pdf?src-supplier=Compliance+Statements; ComponentLink6URL: http://sigma.octopart.com:80/141158212/rohs_statement/Stackpole-Electronics-CSSH0805FT2L00.pdf?src-supplier=Compliance+Statements; ComponentLink6Description: http://sigma.octopart.com:80/141158212/rohs_statement/Stackpole-Electronics-CSSH0805FT2L00.pdf?src-supplier=Compliance+Statements; Supplier 1: Mouser; Supplier Part Number 1: 708-CSSH0805FT2L00; .Case/Package: =Case/Package
X2 = Conn_01x01: Generic connector, single row

## Sheet hbridgeC.SchDoc
size A4; SheetNumber: 7; SheetTotal: 11
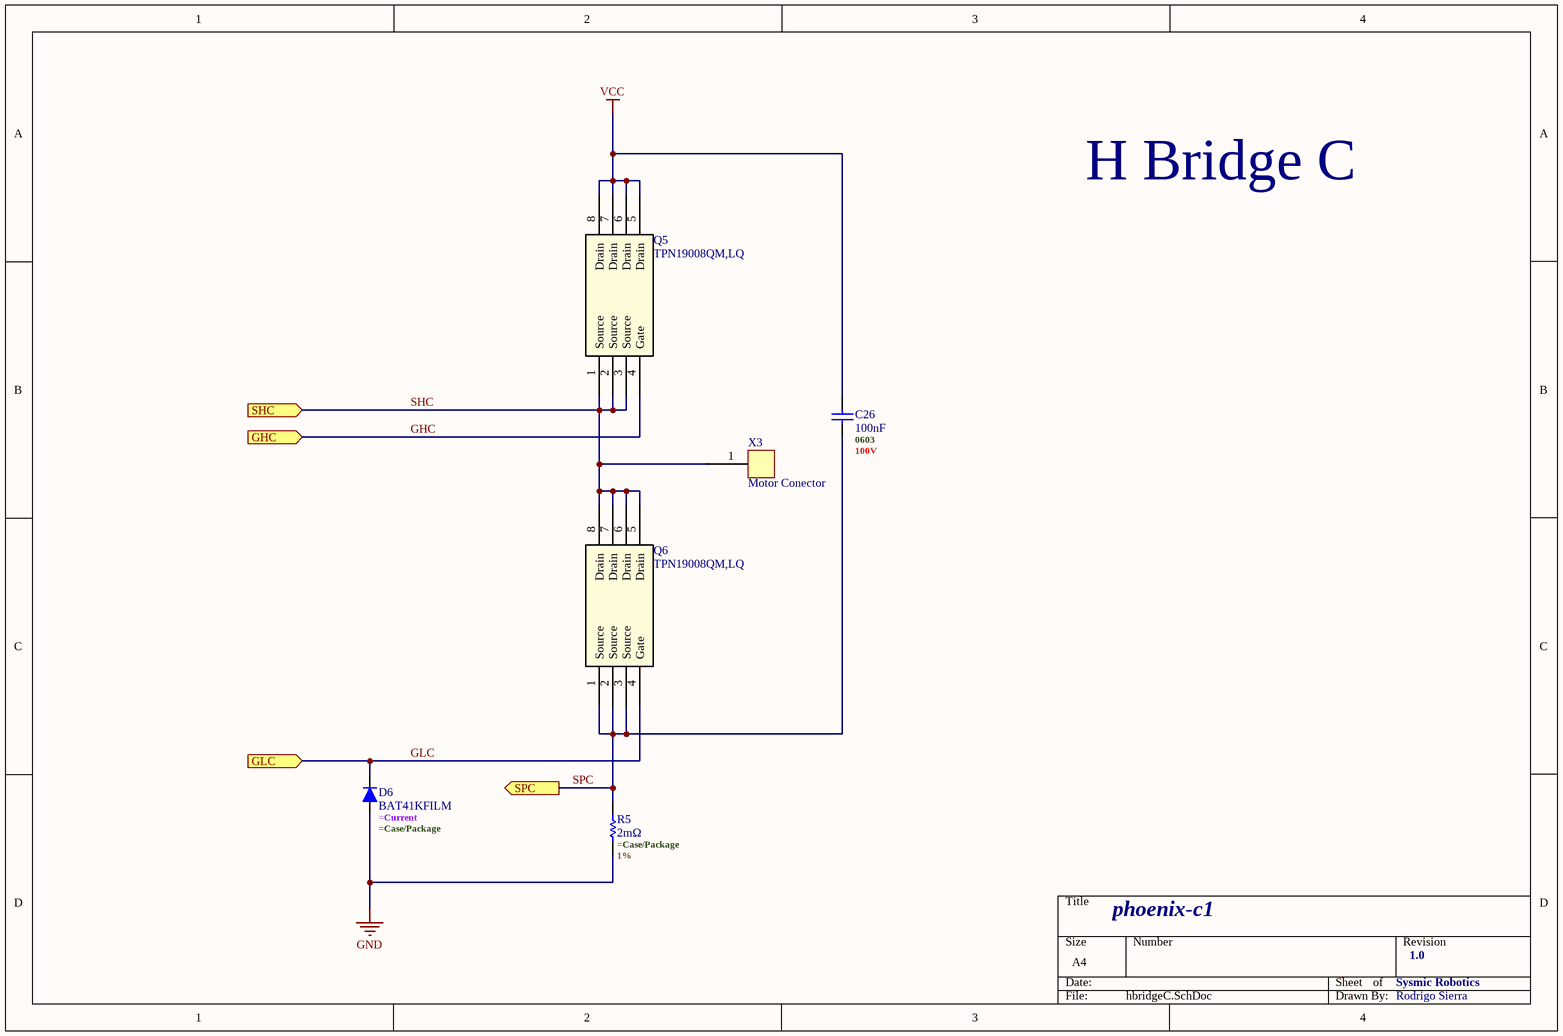
[diagram p5: hbridgeC.SchDoc]

### Parts
C26  100nF  .Case/Package: 0603  .Voltage Rating (DC): 100V  [C0603 - MURATA]
D6  BAT41KFILM  [DSOD-523 - STMicroelectronics]
Q5  TPN19008QM,LQ  [8-TSON - TOSHIBA]
Q6  TPN19008QM,LQ  [8-TSON - TOSHIBA]
R5  2mΩ  .Tolerance: 1%  [R0805 - SEI]
X3  Motor Conector  [CONN_PHASE01x01]

### Ports
GHC (in, see phoenix-c1-sch[4C], gate_driver[3C]), GLC (in, see phoenix-c1-sch[4C], gate_driver[3C]), SHC (in, see phoenix-c1-sch[4C], gate_driver[3C]), SPC (out, see phoenix-c1-sch[4C], gate_driver[3C])

### Nets
GND: D6.2 R5.1
VCC: C26.2 Q5.5(Drain) Q5.6(Drain) Q5.7(Drain) Q5.8(Drain)
GHC: Q5.4(Gate) ; port GHC
GLC: D6.1 Q6.4(Gate) ; port GLC
SHC: Q5.1(Source) Q5.2(Source) Q5.3(Source) Q6.5(Drain) Q6.6(Drain) Q6.7(Drain) Q6.8(Drain) X3.1(Conn) ; port SHC
SPC: C26.1 Q6.1(Source) Q6.2(Source) Q6.3(Source) R5.2 ; port SPC

### Notes on the sheet
- H Bridge C
- phoenix-c1
- Sysmic Robotics
- 1.0
- Rodrigo Sierra

### Library data of the parts
C26 = GCJ188R72A104KA01D: as C24 on sheet hbridgeA; Supplier: Avnet; Supplier Part Number: GCJ188R72A104KA01D; Manufacturer Part Number: GCJ188R72A104KA01D; RoHS: Compliant; Category: Ceramic Capacitors; Stock: 848000; Pricing: 4000=0,02065 (USD); Value: 100nF; Case/Package: 0603; Case Code (Imperial): 0603; Case Code (Metric): 1608; Dielectric Material: Ceramic; Features: Soft Termination; Height: 800µm; Lead Free: Lead Free; Length: 1.6mm; Lifecycle Status: Production; Material: Ceramic; Max Operating Temperature: 125°C; Min Operating Temperature: -55°C; Mounting Technology: Surface Mount; Number of Terminals: 2; Ratings: AEC-Q200; REACH SVHC: Yes; Schedule B: 8532240020, 8532240020|8532240020, 8532240020|8532240020|8532240020, 8532240020|8532240020|8532240020|8532240020; Tolerance: 10%; Voltage Rating: 100V; Voltage Rating (DC): 100V; Width: 800µm; ComponentLink1URL: https://datasheet.octopart.com:443/GCJ188R72A104KA01D-Murata-datasheet-141264712.pdf?src-supplier=Geoflip; ComponentLink1Description: https://datasheet.octopart.com:443/GCJ188R72A104KA01D-Murata-datasheet-141264712.pdf?src-supplier=Geoflip; ComponentLink2URL: https://datasheet.octopart.com:443/GCJ188R72A104KA01D-Murata-datasheet-140654819.pdf?src-supplier=Ciiva; ComponentLink2Description: https://datasheet.octopart.com:443/GCJ188R72A104KA01D-Murata-datasheet-140654819.pdf?src-supplier=Ciiva; ComponentLink3URL: https://datasheet.octopart.com:443/GCJ188R72A104KA01D-Murata-datasheet-138714490.pdf?src-supplier=Ciiva; ComponentLink3Description: https://datasheet.octopart.com:443/GCJ188R72A104KA01D-Murata-datasheet-138714490.pdf?src-supplier=Ciiva; ComponentLink4URL: https://datasheet.octopart.com:443/GCJ188R72A104KA01D-Murata-datasheet-165611796.pdf?src-supplier=TME; ComponentLink4Description: https://datasheet.octopart.com:443/GCJ188R72A104KA01D-Murata-datasheet-165611796.pdf?src-supplier=TME; ComponentLink5URL: https://datasheet.octopart.com:443/GCJ188R72A104KA01D-Murata-datasheet-128592638.pdf?src-supplier=X-ON; ComponentLink5Description: https://datasheet.octopart.com:443/GCJ188R72A104KA01D-Murata-datasheet-128592638.pdf?src-supplier=X-ON; ComponentLink6URL: https://datasheet.octopart.com:443/GCJ188R72A104KA01D-Murata-datasheet-78375067.pdf?src-supplier=Future+Electronics; ComponentLink6Description: https://datasheet.octopart.com:443/GCJ188R72A104KA01D-Murata-datasheet-78375067.pdf?src-supplier=Future+Electronics; ComponentLink7URL: https://datasheet.octopart.com:443/GCJ188R72A104KA01D-Murata-datasheet-12532847.pdf?src-supplier=Future+Electronics; ComponentLink7Description: https://datasheet.octopart.com:443/GCJ188R72A104KA01D-Murata-datasheet-12532847.pdf?src-supplier=Future+Electronics; ComponentLink8URL: http://sigma.octopart.com:80/reach_statement/Murata-company-16.pdf?src-supplier=Compliance+Statements; ComponentLink8Description: http://sigma.octopart.com:80/reach_statement/Murata-company-16.pdf?src-supplier=Compliance+Statements; Supplier 1: Mouser; Supplier Part Number 1: 81-GCJ188R72A104KA1D
D6 = BAT41KFILM: as D4 on sheet hbridgeA; Supplier: Mouser; Supplier Part Number: 511-BAT41KFILM; Manufacturer Part Number: BAT41KFILM; RoHS: Compliant; Category: Schottky Diodes; Stock: 54328; Pricing: 1=0,34, 10=0,206, 50=0,206, 100=0,129, 1000=0,085, 10000=0,054 (USD); China RoHS: Compliant; Contact Plating: Tin; Current Rating: 200mA; Forward Current: 200mA; Height: 700µm; Lead Free: Lead Free; Length: 1.3mm; Lifecycle Status: Production; Max Operating Temperature: 150°C; Max Output current: 200mA; Max Reverse Voltage (DC): 100V; Max Surge Current: 1A; Min Operating Temperature: -65°C; Mounting Technology: Surface Mount; Pins: 2; Number of Terminals: 2; Output Current: 200mA; Packaging: Tape and Reel; Peak Non-Repetitive Surge Current: 1A; Peak Reverse Current: 100nA; Radiation Hardening: No; REACH SVHC: Yes; Reverse Standoff Voltage: 100V; Schedule B: 8541100070, 8541100070|8541100070|8541100070|8541100070|8541100070; Voltage Rating (DC): 100V; Width: 900µm; ComponentLink1URL: https://datasheet.octopart.com:443/BAT41KFILM-STMicroelectronics-datasheet-12514395.pdf?src-supplier=Upverter; ComponentLink1Description: https://datasheet.octopart.com:443/BAT41KFILM-STMicroelectronics-datasheet-12514395.pdf?src-supplier=Upverter; ComponentLink2URL: https://datasheet.octopart.com:443/BAT41KFILM-STMicroelectronics-datasheet-8379388.pdf?src-supplier=element14+APAC; ComponentLink2Description: https://datasheet.octopart.com:443/BAT41KFILM-STMicroelectronics-datasheet-8379388.pdf?src-supplier=element14+APAC; ComponentLink3URL: https://datasheet.octopart.com:443/BAT41KFILM-STMicroelectronics-datasheet-165583346.pdf?src-supplier=Newark; ComponentLink3Description: https://datasheet.octopart.com:443/BAT41KFILM-STMicroelectronics-datasheet-165583346.pdf?src-supplier=Newark; ComponentLink4URL: https://datasheet.octopart.com:443/BAT41KFILM-STMicroelectronics-datasheet-109502.pdf?src-supplier=Nu+Horizons; ComponentLink4Description: https://datasheet.octopart.com:443/BAT41KFILM-STMicroelectronics-datasheet-109502.pdf?src-supplier=Nu+Horizons; Supplier 1: Mouser; Supplier Part Number 1: 511-BAT41KFILM; .Current: =Current; .Case/Package: =Case/Package
Q5 Q6 = TPN19008QM,LQ: as Q1 on sheet hbridgeA; Copyright: Copyright (C) 2025 Ultra Librarian. All rights reserved.; Manufacturer_Part_Number: TPN19008QM,LQ; RefDes: RefDes; Type: Type; Supplier 1: Mouser; Supplier Part Number 1: 757-TPN19008QM,LQ
R5 = CSSH0805FT2L00: as R3 on sheet hbridgeA; Supplier: Mouser; Supplier Part Number: 708-CSSH0805FT2L00; Manufacturer Part Number: CSSH0805FT2L00; RoHS: Compliant; Category: Chip SMD Resistors; Stock: 6684; Pricing: 1=0,6, 10=0,385, 50=0,29, 100=0,261, 1000=0,188, 10000=0,144 (USD); Height: 350µm; Lifecycle Status: Production; Max Operating Temperature: 170°C; Min Operating Temperature: -55°C; Mounting Technology: Surface Mount; Number of Terminals: 2; Power Dissipation: 1W; REACH SVHC: Yes; Value: 2mΩ; Schedule B: 8533210045, 8533210045|8533210045|8533210045|8533210045|8533210045; Tolerance: 1%; Width: 1.3mm; ComponentLink1URL: https://datasheet.octopart.com:443/CSSH0805FT2L00-Stackpole-Electronics-datasheet-182147922.pdf?src-supplier=IHS; ComponentLink1Description: https://datasheet.octopart.com:443/CSSH0805FT2L00-Stackpole-Electronics-datasheet-182147922.pdf?src-supplier=IHS; ComponentLink2URL: https://datasheet.octopart.com:443/CSSH0805FT2L00-Stackpole-Electronics-datasheet-141193806.pdf?src-supplier=Stackpole+Electronics; ComponentLink2Description: https://datasheet.octopart.com:443/CSSH0805FT2L00-Stackpole-Electronics-datasheet-141193806.pdf?src-supplier=Stackpole+Electronics; ComponentLink3URL: https://datasheet.octopart.com:443/CSSH0805FT2L00-Stackpole-Electronics-datasheet-141158304.pdf?src-supplier=Stackpole+Electronics; ComponentLink3Description: https://datasheet.octopart.com:443/CSSH0805FT2L00-Stackpole-Electronics-datasheet-141158304.pdf?src-supplier=Stackpole+Electronics; ComponentLink4URL: https://datasheet.octopart.com:443/CSSH0805FT2L00-Stackpole-Electronics-datasheet-101746695.pdf?src-supplier=Future+Electronics; ComponentLink4Description: https://datasheet.octopart.com:443/CSSH0805FT2L00-Stackpole-Electronics-datasheet-101746695.pdf?src-supplier=Future+Electronics; ComponentLink5URL: http://sigma.octopart.com:80/141158211/reach_statement/Stackpole-Electronics-CSSH0805FT2L00.pdf?src-supplier=Compliance+Statements; ComponentLink5Description: http://sigma.octopart.com:80/141158211/reach_statement/Stackpole-Electronics-CSSH0805FT2L00.pdf?src-supplier=Compliance+Statements; ComponentLink6URL: http://sigma.octopart.com:80/141158212/rohs_statement/Stackpole-Electronics-CSSH0805FT2L00.pdf?src-supplier=Compliance+Statements; ComponentLink6Description: http://sigma.octopart.com:80/141158212/rohs_statement/Stackpole-Electronics-CSSH0805FT2L00.pdf?src-supplier=Compliance+Statements; Supplier 1: Mouser; Supplier Part Number 1: 708-CSSH0805FT2L00; .Case/Package: =Case/Package
X3 = Conn_01x01: Generic connector, single row